# Altium project ESE5160_Co1n1oT.PrjPcb (part 2 of 2)
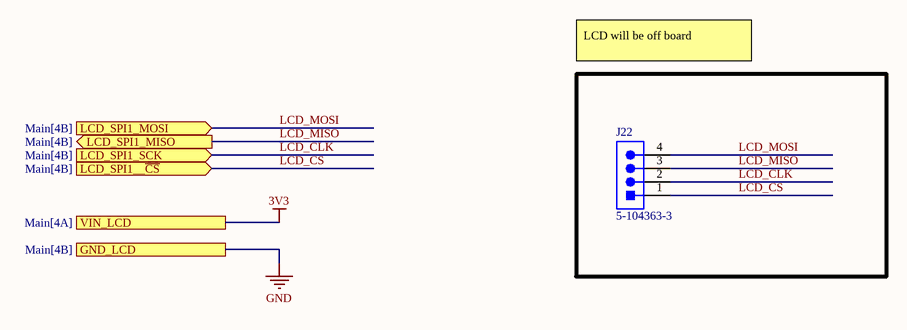
[diagram p9: 358LCD.SchDoc]

## Nets that join several sheets
3V3: Main (J17.2 J18.2 JP22.2 R7.2), MCU (7 pins), Memory (6 pins)
GND: Main (15 pins), FTDI (10 pins), MCU (19 pins), LiPo_Charger (13 pins), Memory (7 pins), BUCK (5 pins), BOOST (12 pins), STATUS_RGB (DS1.2)
IN: Main (JP12.2), BOOST (6 pins)
OUT: Main (JP22.1), BUCK (C9.2 L1.2 R4.1 U4.5)
VBAT: Main (J4.1 TP5.1), LiPo_Charger (C26.2 U2.2 U2.3)
VBOHYS: Main (TP20.1), BOOST (U5.8)
VBOPG: Main (TP22.1), BOOST (U5.5)
VBUFB: Main (TP21.1), BUCK (U4.4)
VBUPG: Main (TP19.1), BUCK (R4.2 U4.6)
VBUS: Main (J1.1), FTDI (C2.2 D1.4 FB1.1)
VIN: Main (JP1.2), BUCK (C8.2 U4.1 U4.8)
Vout: Main (JP23.1), BOOST (10 pins)
Vsystem: Main (JP1.1 JP12.1 TP18.1), LiPo_Charger (5 pins)
VUSB: Main (TP1.1), FTDI (6 pins), LiPo_Charger (C24.2 JP8.2 JP9.1 U2.13)
BUZZER PWM-: Main (Q2.2), MCU (U3.9)
FLASH_MEM_SPI_~{CS}: MCU (U3.37), Memory (DN1.10 TP16.1)
GREEN_LED_1: Main (R13.1), MCU (U3.36)
GREEN_LED_2: Main (R14.1), MCU (U3.22)
I2C_0(SCL) LIGHT SENSOR: Main (JP20.1), MCU (U3.39)
I2C_0(SDA) LIGHT SENSOR: Main (JP21.1), MCU (U3.38)
LCD_~{CS}: Main (JP27.2), 358LCD (J22.1)
LCD_CLK: Main (JP26.2), 358LCD (J22.2)
LCD_MISO: Main (JP25.2), 358LCD (J22.3)
LCD_MOSI: Main (JP24.2), 358LCD (J22.4)
LCD_SPI1_~{CS}: Main (JP27.1), MCU (U3.13)
LCD_SPI1_CLK: Main (JP26.1), MCU (U3.14)
LCD_SPI1_MISO: Main (JP25.1), MCU (U3.28)
LCD_SPI1_MOSI: Main (JP24.1), MCU (U3.27)
LOCK_SIGNAL_SWITCH: Main (JP19.1), MCU (U3.15)
MCU_LED: Main (D8.K), MCU (U3.16)
MCU_RxI_UART_CLI: Main (TP2.1), FTDI (U1.7), MCU (U3.44)
MCU_TxO_UART_CLI: Main (TP4.1), FTDI (U1.10), MCU (U3.43)
MEM_SPI_CIPO: Main (JP3.2), Memory (DN1.15 TP14.1)
MEM_SPI_CLK: Main (JP4.2), Memory (DN1.14 TP15.1)
MEM_SPI_COPI: Main (JP2.2), Memory (DN1.11 TP13.1)
MOTOR PWM+: Main (JP14.1), MCU (U3.35)
SERCOM1_PAD2_SPI_CIPO: Main (JP3.1), MCU (U3.8)
SERCOM1_PAD2_SPI_COPI: Main (JP2.1), MCU (U3.11)
SERCOM1_PAD3_SPI_SCK: Main (JP4.1), MCU (U3.12)
SPARE 1: Main (J19.1), MCU (U3.41)
SPARE 2: Main (J19.2), MCU (U3.40)
SPARE 3: Main (J19.3), MCU (U3.34)
SPARE 4: Main (J19.4), MCU (U3.23)
STATUS RGB PIN_1: Main (JP17.1), MCU (U3.31)
STATUS RGB PIN_2: Main (JP18.1), MCU (U3.33)
STATUS_RGB_GREEN: Main (JP18.2), STATUS_RGB (R9.2)
STATUS_RGB_RED: Main (JP17.2), STATUS_RGB (R8.2)
USB_DATA_N: Main (J1.2), FTDI (C5.2 D1.2 R1.1)
USB_DATA_P: Main (J1.3), FTDI (C6.2 D1.3 R2.1)

## Assembly variants
Build_Alt: not fitted DS1 FD1 FD2 FD3 J4 J15 J16 J17 J18 J19 J20 J21 J22 LS1 Q2 TP1 TP2 TP3 TP4 TP5 TP6 TP7 TP8 TP9 TP10 TP11 TP12 TP13 TP14 TP15 TP16